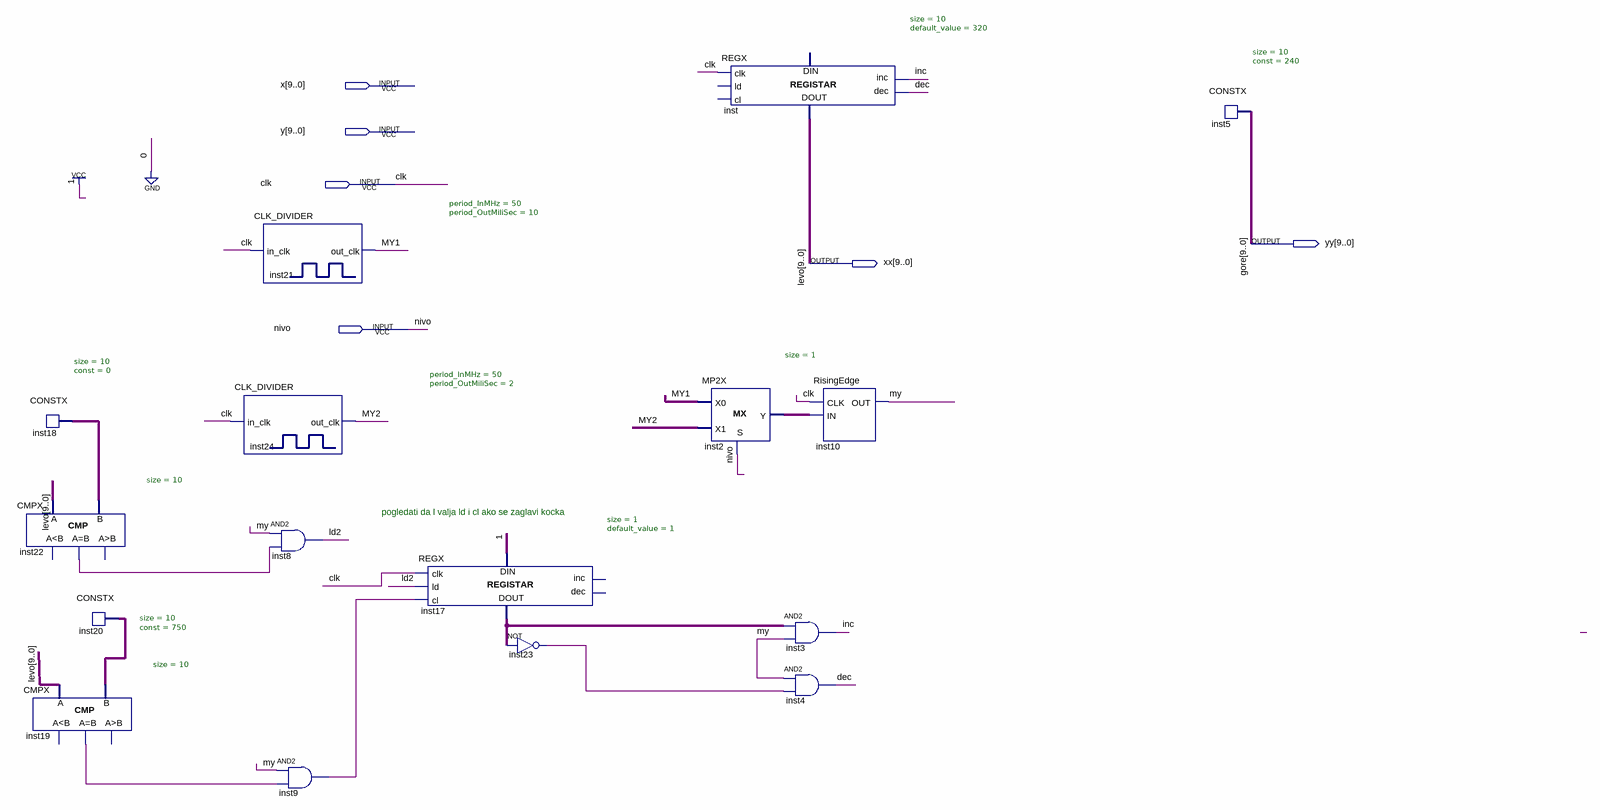
[diagram p0: schematic sheet]
// Quartus schematic kocka1.bdf as structural Verilog: 16 symbols, 6 pins
module kocka1 (
  input  [9:0] x,
  input  [9:0] y,
  input  clk,
  input  nivo,
  output [9:0] yy,
  output [9:0] xx
);

  wire dec, inc, inst2_y, inst9_out, inst17_data_out, inst19_eq, inst22_eq, inst23_out, ld2, my, MY1, MY2;
  wire [9:0] inst18_data, inst20_data;

  CONSTX #(.size(10), .\const (0)) inst18 (.data(inst18_data));
  CMPX #(.size(10)) inst22 (.A(xx), .B(inst18_data), .eq(inst22_eq));  // open: ls, gr
  CMPX #(.size(10)) inst19 (.A(xx), .B(inst20_data), .eq(inst19_eq));  // open: ls, gr
  CONSTX #(.size(10), .\const (750)) inst20 (.data(inst20_data));
  CLK_DIVIDER #(.period_InMHz(50), .period_OutMiliSec(10)) inst21 (.in_clk(clk), .out_clk(MY1));
  CLK_DIVIDER #(.period_InMHz(50), .period_OutMiliSec(2)) inst24 (.in_clk(clk), .out_clk(MY2));
  and inst8 (ld2, my, inst22_eq);
  and inst9 (inst9_out, my, inst19_eq);
  REGX #(.size(1), .default_value(1)) inst17 (
    .clk(clk), .ld(ld2), .cl(inst9_out), .data_in(1'b1), .data_out(inst17_data_out));  // open: inc, dec
  not inst23 (inst23_out, inst17_data_out);
  REGX #(.size(10), .default_value(320)) inst (
    .clk(clk), .inc(inc), .dec(dec), .data_out(xx));  // open: ld, cl, data_in
  MP2X #(.size(1)) inst2 (.S(nivo), .X0(MY1), .X1(MY2), .Y(inst2_y));
  and inst3 (inc, inst17_data_out, my);
  and inst4 (dec, my, inst23_out);
  RisingEdge inst10 (.CLK(clk), .IN(inst2_y), .OUT(my));
  CONSTX #(.size(10), .\const (240)) inst5 (.data(yy));

  // Other names for the same wires on the sheet: gore[9:0] = yy; levo[9:0] = xx

  // Notes on the sheet:
  //   pogledati da l valja ld i cl ako se zaglavi kocka
endmodule
